# Altium project Daughter_Card.PrjPcb
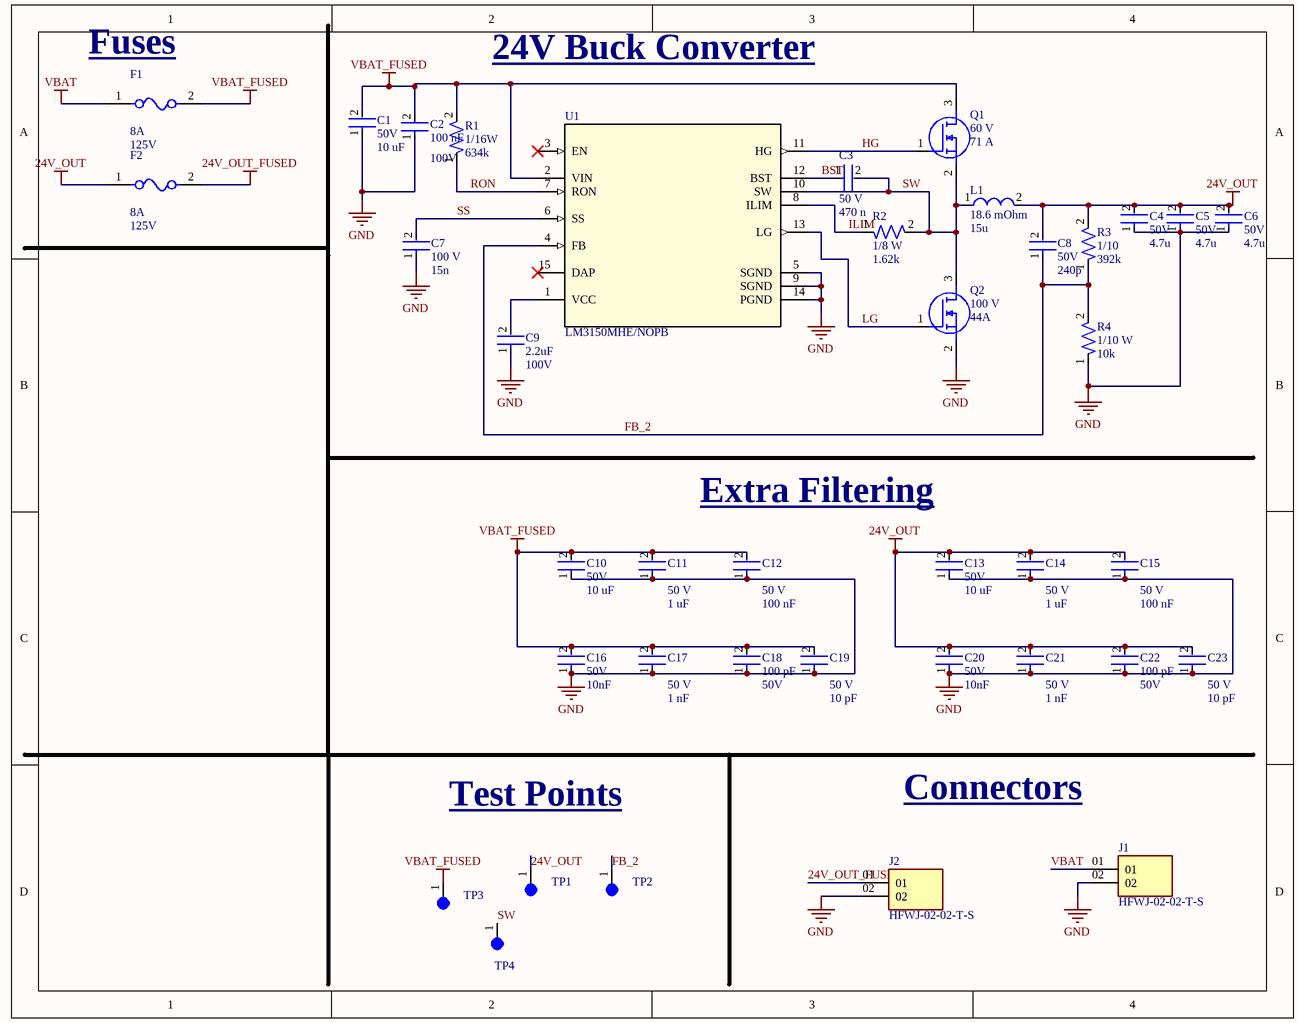
[diagram p0: Daughter_Card.SchDoc]
1 sheet, 39 parts. Net scope: global (net labels, ports and power ports of the same name join across sheets).
Board file: Daughter_Card.PcbDoc

## Sheet Daughter_Card.SchDoc
size A; SheetNumber: 1; SheetTotal: 1; SPICEModelCacheSUSSEWTI: <root> / <DocumentId>SUSSEWTI</DocumentId> / <CacheFrame Number="0"> / <Model Name="cgd" Kind="CKT"> / <Text>.subckt	cgd	1	2	3	4 / e1	5	0	value	{abs(v(3,4))} / r1	5	0	1e6 / e2	6	0	table	{v(5,0)}= / +	(	0	6.03899E-11	) / +	(	1	4.8927E-11	) / +	(	2	4.30907E-11	) / +	(	3	3.87922E-11	) / +	(	4	3.42734E-11	) / +	(	5	3.03383E-11	) / +	(	6	2.68435E-11	) / +	(	7	2.23946E-11	) / +	(	8	1.18648E-11	) / +	(	9	9.77143E-12	) / +	(	10	9.49534E-12	) / +	(	11	9.27167E-12	) / +	(	12	9.07946E-12	) / +	(	13	8.90822E-12	) / +	(	14	8.74746E-12	) / +	(	15	8.59718E-12	) / +	(	16	8.45739E-12	) / +	(	17	8.32459E-12	) / +	(	18	8.19528E-12	) / +	(	19	8.07646E-12	) / +	(	20	7.95763E-12	) / +	(	21	7.84231E-12	) / +	(	22	7.72348E-12	) / +	(	23	7.60466E-12	) / +	(	24	7.48234E-12	) / +	(	25	7.35653E-12	) / +	(	26	7.23072E-12	) / +	(	27	7.1084E-12	) / +	(	28	6.98259E-12	) / +	(	29	6.86376E-12	) / +	(	30	6.75193E-12	) / +	(	31	6.64359E-12	) / +	(	32	6.54574E-12	) / +	(	33	6.45487E-12	) / +	(	34	6.37449E-12	) / +	(	35	6.3011E-12	) / +	(	36	6.2347E-12	) / +	(	37	6.1718E-12	) / +	(	38	6.11937E-12	) / +	(	39	6.07045E-12	) / +	(	40	6.02502E-12	) / +	(	41	5.98308E-12	) / +	(	42	5.94464E-12	) / +	(	43	5.90619E-12	) / +	(	44	5.87474E-12	) / +	(	45	5.83979E-12	) / +	(	46	5.81183E-12	) / +	(	47	5.78038E-12	) / +	(	48	5.75242E-12	) / +	(	49	5.72446E-12	) / +	(	50	5.7E-12	) / +	(	51	5.67554E-12	) / +	(	52	5.65107E-12	) / +	(	53	5.6301E-12	) / +	(	54	5.60564E-12	) / +	(	55	5.58467E-12	) / +	(	56	5.5637E-12	) / +	(	57	5.54273E-12	) / +	(	58	5.52177E-12	) / +	(	59	5.5008E-12	) / +	(	60	5.48332E-12	) / +	(	61	5.46235E-12	) / +	(	62	5.44139E-12	) / +	(	63	5.42391E-12	) / +	(	64	5.40294E-12	) / +	(	65	5.38197E-12	) / +	(	66	5.36101E-12	) / +	(	67	5.34353E-12	) / +	(	68	5.32256E-12	) / +	(	69	5.30159E-12	) / +	(	70	5.28063E-12	) / +	(	71	5.25966E-12	) / +	(	72	5.24218E-12	) / +	(	73	5.22121E-12	) / +	(	74	5.20025E-12	) / +	(	75	5.18277E-12	) / +	(	76	5.1618E-12	) / +	(	77	5.14083E-12	) / +	(	78	5.12336E-12	) / +	(	79	5.10589E-12	) / +	(	80	5.08492E-12	) / +	(	81	5.06744E-12	) / +	(	82	5.04997E-12	) / +	(	83	5.0325E-12	) / +	(	84	5.01502E-12	) / +	(	85	4.99755E-12	) / +	(	86	4.98007E-12	) / +	(	87	4.9626E-12	) / +	(	88	4.94513E-12	) / +	(	89	4.93115E-12	) / +	(	90	4.91367E-12	) / +	(	91	4.89969E-12	) / +	(	92	4.88222E-12	) / +	(	93	4.86824E-12	) / +	(	94	4.85426E-12	) / +	(	95	4.84028E-12	) / +	(	96	4.8263E-12	) / +	(	97	4.8263E-12	) / +	(	98	4.83329E-12	) / +	(	99	4.83679E-12	) / +	(	100	4.84378E-12	) / r2	6	0	1e6 / c1	3	7	1e-15 / v1	7	0	DC	0.0V / e3	8	0	value	{1*I(v1)} / r3	8	0	1e6 / g1	1	2	value	{-1e15*v(6,0)*v(8,0)} / .ends cgd</Text> / </Model> / <Model Name="cds" Kind="CKT"> / <Text>.subckt	cds	1	2	3	4 / e1	5	0	value	{abs(v(3,4))} / r1	5	0	1e6 / e2	6	0	table	{v(5,0)}= / +	(	0	1.72961E-09	) / +	(	1	1.47107E-09	) / +	(	2	1.28891E-09	) / +	(	3	1.15721E-09	) / +	(	4	1.04573E-09	) / +	(	5	9.58662E-10	) / +	(	6	8.82357E-10	) / +	(	7	7.84305E-10	) / +	(	8	5.93335E-10	) / +	(	9	5.34129E-10	) / +	(	10	5.05505E-10	) / +	(	11	4.81828E-10	) / +	(	12	4.61721E-10	) / +	(	13	4.44392E-10	) / +	(	14	4.29553E-10	) / +	(	15	4.16703E-10	) / +	(	16	4.05843E-10	) / +	(	17	3.96875E-10	) / +	(	18	3.89905E-10	) / +	(	19	3.85024E-10	) / +	(	20	3.82242E-10	) / +	(	21	3.81658E-10	) / +	(	22	3.82877E-10	) / +	(	23	3.85795E-10	) / +	(	24	3.89618E-10	) / +	(	25	3.93643E-10	) / +	(	26	3.97369E-10	) / +	(	27	3.99992E-10	) / +	(	28	4.01217E-10	) / +	(	29	4.00836E-10	) / +	(	30	3.98748E-10	) / +	(	31	3.95056E-10	) / +	(	32	3.89954E-10	) / +	(	33	3.83645E-10	) / +	(	34	3.76426E-10	) / +	(	35	3.68499E-10	) / +	(	36	3.60265E-10	) / +	(	37	3.51728E-10	) / +	(	38	3.43281E-10	) / +	(	39	3.3493E-10	) / +	(	40	3.26675E-10	) / +	(	41	3.18717E-10	) / +	(	42	3.11055E-10	) / +	(	43	3.03494E-10	) / +	(	44	2.96225E-10	) / +	(	45	2.8906E-10	) / +	(	46	2.82188E-10	) / +	(	47	2.7542E-10	) / +	(	48	2.68748E-10	) / +	(	49	2.62276E-10	) / +	(	50	2.558E-10	) / +	(	51	2.49524E-10	) / +	(	52	2.43349E-10	) / +	(	53	2.3727E-10	) / +	(	54	2.31194E-10	) / +	(	55	2.25315E-10	) / +	(	56	2.19636E-10	) / +	(	57	2.14057E-10	) / +	(	58	2.08678E-10	) / +	(	59	2.03499E-10	) / +	(	60	1.98717E-10	) / +	(	61	1.94238E-10	) / +	(	62	1.89959E-10	) / +	(	63	1.86076E-10	) / +	(	64	1.82497E-10	) / +	(	65	1.79218E-10	) / +	(	66	1.76239E-10	) / +	(	67	1.73456E-10	) / +	(	68	1.70877E-10	) / +	(	69	1.68598E-10	) / +	(	70	1.66419E-10	) / +	(	71	1.6444E-10	) / +	(	72	1.62558E-10	) / +	(	73	1.60879E-10	) / +	(	74	1.593E-10	) / +	(	75	1.57817E-10	) / +	(	76	1.56438E-10	) / +	(	77	1.55159E-10	) / +	(	78	1.53877E-10	) / +	(	79	1.52794E-10	) / +	(	80	1.51715E-10	) / +	(	81	1.50733E-10	) / +	(	82	1.4975E-10	) / +	(	83	1.48868E-10	) / +	(	84	1.48085E-10	) / +	(	85	1.47302E-10	) / +	(	86	1.4652E-10	) / +	(	87	1.45837E-10	) / +	(	88	1.45155E-10	) / +	(	89	1.44569E-10	) / +	(	90	1.43986E-10	) / +	(	91	1.434E-10	) / +	(	92	1.42918E-10	) / +	(	93	1.42332E-10	) / +	(	94	1.41846E-10	) / +	(	95	1.4146E-10	) / +	(	96	1.40974E-10	) / +	(	97	1.40874E-10	) / +	(	98	1.40867E-10	) / +	(	99	1.40963E-10	) / +	(	100	1.40956E-10	) / r2	6	0	1e6 / c1	3	7	1e-15 / v1	7	0	DC	0.0V / e3	8	0	value	{1*I(v1)} / r3	8	0	1e6 / g1	1	2	value	{-1e15*v(6,0)*v(8,0)} / .ends cds</Text> / </Model> / <Model Name="vth_temp" Kind="CKT"> / <Text>******************************************************************* / .subckt vth_temp toutp	toutn / i1	0	101	1e-6 / R1	101	0	1		tc=1.00e-3, 0.00e-3 / V1	0	102	DC	1V / E1	103 102	101	0	1e6 / r2	103	0	1 / V2	104	0	DC	25V / E2	105	104	103	0	1e3 / r3	105	0	1 / E3	toutp	toutn	POLY(1) (105,0) -2.18e-2 8.63e-4 -8.22e-6 / *E3	toutp	toutn	POLY(1) (105,0) 0 0 / .ends	vth_temp</Text> / </Model> / <Model Name="csd19534q5a" Kind="CKT"> / <Text>******************************************************************* / .SUBCKT csd19534q5a  1 2 3 / * PARAMETER (local) DEFINITIONS SECTION / .PARAM  ptrc1    12.00e-3 / .PARAM  ptrc2    3.50e-5 / .PARAM  pwidthP  2.1 / .PARAM  pwidth   {pwidthP*1e6} / .PARAM  perimP   {2.1*pwidthP} / .PARAM  perim    {perimP*1e6} / ****** MODEL SUBCIRCUIT BEGINS HERE     ****************************** / M1   10 11 12 12  NMOS	W={pwidthP} L=0.5u  PS={perimP} PD={perimP} / *M2   12 11 12 20  PMOSd W={pwidthP} L=0.05u PS={perimP} PD={perimP} / *DDx  20  10  DDx / * Note:  gate oxide capacitance included in NMOS below / xcgd	5	10	1	3	cgd / cgs	5	8	0.63e-9 / *xcgs	5	8	1	3	cgs / xcds	8	10	1	3	cds / xvth	110	11	vth_temp / DBD	3	1	DBD / LGG   2  5	 2.1e-9 / RGG   5 110	 6.00 / RSB  12  9	 RTEMP 0.23166e-3 / R   9  8 	 RTEMP 0.23166e-3 / RSP   8  6 	 {0.45e-3+1.3e-3*0} / L   6  3	 0.47e-9 / RSL   6  3   0.5 / RDD   7 10 	 RTEMP 5.85e-3 / RDP   4  7	 {0.5e-4+0.52e-3+4.25e-3} / LDD   1  4	 0.05e-9 / ******************************************************************* / .MODEL  NMOS   NMOS ( / * CONTROL PARAMETERS / + LEVEL  = 7             VERSION = 3.2         CAPMOD = 2 / * DC PARAMETERS / + NLX    = 1.74E-7       VBM    = -5           DVT0   = 2.2 / + DVT1   = 0.53          DVT2   = -0.032       U0     = 600 / + UA     = 1.4e-9        UB     = 5.0e-18      A0     = 1.0 / + AGS    = 0.0           A1     = 0.0          A2     = 1.0 / + LINT   = 0.055e-6      VOFF   = 0.10        NFACTOR= 2.0 / + ETA0   = 0.005         ETAB   = -0.07        DSUB   = 1.4 / + PCLM   = 0.25          PDIBLC1= 0.02         PDIBLC2= 0.004 / + DROUT  = 0.90          PSCBE1 = 3.0e8        PSCBE2 = 1e-6 / + PVAG   = 0.1           DELTA  = 0.0220       JS     = 0 / * AC AND CAPACITANCE PARAMETERS / + CGSO   = 1e-18       CGDO   = 1e-18        CGBO   = 1e-18 / + CJ     = 1e-18         CJSW   = 1e-18        CF     = 0 / * TEMPERATURE PARAMETERS / + TNOM   = 25            UTE    = -1.5         KT1    = -1.125 / + KT1L   = 1.0e-15       KT2    = 0.022        UA1    = 0.25e-10 / + UB1    = -0.8e-18 / * PROCE PARAMETERS / + TOX    = 4.00e-8       XJ     = 3e-7          NCH    = 1.395e17 / + NSUB   = 1.0e16) / ******************************************************************* / .MODEL  PMOSd   PMOS (   LEVEL  = 1 / + TNOM   = 27            VTO    = -0.3          IS     = 6.0e-14 / + TOX    = 4.00e-8       NSUB   = 1.5e18		gamma	=	10 / + CJ     = 1e-18         CJSW   = 1e-18 / + CGSO   = 1e-18         CGDO   = 1e-18         CGBO   = 0  ) / ******************************************************************* / .MODEL DBD D (CJO=7.50e-15 VJ=0.5 M=0.625 TNOM=25 / + FC=0.5 TT=2e-09 XTI=3.3 BV=101 / + IS=1.5e-12 N=1.06 RS=1.60e-3 TRS1=4.0e-3) / ******************************************************************* / .MODEL RTEMP RES (TC1={ptrc1} TC2={ptrc2}) / ******************************************************************* / .ENDS csd19534q5a</Text> / <Dependency>0\cgd</Dependency> / <Dependency>0\cds</Dependency> / <Dependency>0\vth_temp</Dependency> / </Model> / </CacheFrame> / </root>

### Parts
C1  Voltage: 50V  Capacitance: 10 uF  [CAP-1210]  (hidden comment: CL32B106KBJNNNE)
C2  Capacitance: 100 nF  Voltage: 100V  [CAP-0603]  (hidden comment: GMC10X7S104K100NT)
C3  Voltage: 50 V  Capacitance: 470 n  [CAP-0805]  (hidden comment: CC0805ZRY5V9BB474)
C4  Voltage: 50V  Capacitance: 4.7u  [CAP-1210]  (hidden comment: CC1210KFX7R9BB475)
C5  Voltage: 50V  Capacitance: 4.7u  [CAP-1210]  (hidden comment: CC1210KFX7R9BB475)
C6  Voltage: 50V  Capacitance: 4.7u  [CAP-1210]  (hidden comment: CC1210KFX7R9BB475)
C7  Voltage: 100 V  Capacitance: 15n  [CAP-0805]  (hidden comment: CC0805KRX7R0BB153)
C8  Voltage: 50V  Capacitance: 240p  [CAP-0402]  (hidden comment: CC0402FRNPO9BN241)
C9  Capacitance: 2.2uF  Voltage: 100V  [CAP-1206]  (hidden comment: CC1206KKX7R0BB225)
C10  Voltage: 50V  Capacitance: 10 uF  [CAP-1210]  (hidden comment: CL32B106KBJNNNE)
C11  Voltage: 50 V  Capacitance: 1 uF  [CAP-0805]  (hidden comment: CC0805KKX7R9BB105)
C12  Voltage: 50 V  Capacitance: 100 nF  [CAP-0805]  (hidden comment: CC0805KRX7R9BB104)
C13  Voltage: 50V  Capacitance: 10 uF  [CAP-1210]  (hidden comment: CL32B106KBJNNNE)
C14  Voltage: 50 V  Capacitance: 1 uF  [CAP-0805]  (hidden comment: CC0805KKX7R9BB105)
C15  Voltage: 50 V  Capacitance: 100 nF  [CAP-0805]  (hidden comment: CC0805KRX7R9BB104)
C16  Voltage: 50V  Capacitance: 10nF  [CAP-0805]  (hidden comment: GRM2195C1H103JA01D)
C17  Voltage: 50 V  Capacitance: 1 nF  [CAP-0402]  (hidden comment: CC0402KRX7R9BB102)
C18  Capacitance: 100 pF  Voltage: 50V  [CAP-0402]  (hidden comment: CC0402JRNPO9BN101)
C19  Voltage: 50 V  Capacitance: 10 pF  [CAP-0402]  (hidden comment: CC0402JRNPO9BN100)
C20  Voltage: 50V  Capacitance: 10nF  [CAP-0805]  (hidden comment: GRM2195C1H103JA01D)
C21  Voltage: 50 V  Capacitance: 1 nF  [CAP-0402]  (hidden comment: CC0402KRX7R9BB102)
C22  Capacitance: 100 pF  Voltage: 50V  [CAP-0402]  (hidden comment: CC0402JRNPO9BN101)
C23  Voltage: 50 V  Capacitance: 10 pF  [CAP-0402]  (hidden comment: CC0402JRNPO9BN100)
F1  Fuse Current: 8A  Voltage Rating: 125V  [FUSE-0001]  (hidden comment: 01550900M)
F2  Fuse Current: 8A  Voltage Rating: 125V  [FUSE-0001]  (hidden comment: 01550900M)
J1  HFWJ-02-02-T-S  [SAMTEC_HFWJ-02-02-T-S]
J2  HFWJ-02-02-T-S  [SAMTEC_HFWJ-02-02-T-S]
L1  Resistance: 18.6 mOhm  Inductor: 15u  [IND_XAL1010_COC]  (hidden comment: XAL1010-153MED)
Q1  Max Voltage: 60 V  Max Current: 71 A  [NTMFS5C670NLT1G_ONS - duplicate]  (hidden comment: NTMFS5C670NLT1G)
Q2  Voltage Max: 100 V  Current Max: 44A  [TRANS_CSD19534Q5A]  (hidden comment: CSD19534Q5A)
R1  Power: 1/16W  Resistance: 634k  [RES-0402]  (hidden comment: RC0402FR-07634KL)
R2  Power: 1/8 W  Resistance: 1.62k  [RES-0805]  (hidden comment: RC0805FR-071K62L)
R3  Power: 1/10  Resistance: 392k  [RES-0603]  (hidden comment: RC0603FR-07392KL)
R4  Power: 1/10 W  Resistance: 10k  [CAP-0603]  (hidden comment: RC0603FR-0710KL)
TP1  5003  [TEST-POINT-0001]  (value not drawn)
TP2  5003  [TEST-POINT-0001]  (value not drawn)
TP3  5003  [TEST-POINT-0001]  (value not drawn)
TP4  5003  [TEST-POINT-0001]  (value not drawn)
U1  LM3150MHE/NOPB  [MXA14A]

### Nets
24V_OUT: C4.2 C5.2 C6.2 C8.2 C13.2 C14.2 C15.2 C20.2 C21.2 C22.2 C23.2 F2.1 L1.2 R3.2 TP1.1
24V_OUT_FUSED: F2.2 J2.01
GND: C1.1 C2.1 C4.1 C5.1 C6.1 C7.1 C9.1 C10.1 C11.1 C12.1 C13.1 C14.1 C15.1 C16.1 C17.1 C18.1 C19.1 C20.1 C21.1 C22.1 C23.1 J1.02 J2.02 Q2.2(S) R4.1 U1.5(SGND) U1.9(SGND) U1.14(PGND)
VBAT: F1.1 J1.01
VBAT_FUSED: C1.2 C2.2 C10.2 C11.2 C12.2 C16.2 C17.2 C18.2 C19.2 F1.2 Q1.3(D) R1.2 TP3.1 U1.2(VIN)
BST: C3.1 U1.12(BST)
FB_2: C8.1 R3.1 R4.2 TP2.1 U1.4(FB)
HG: Q1.1(G) U1.11(HG)
ILIM: R2.1 U1.8(ILIM)
LG: Q2.1(G) U1.13(LG)
RON: R1.1 U1.7(RON)
SS: C7.2 U1.6(SS)
SW: C3.2 L1.1 Q1.2(S) Q2.3(D) R2.2 TP4.1 U1.10(SW)
NetC9_2: C9.2 U1.1(VCC)

Not connected (* = marked no-connect by the designer): U1 3(EN)* 15(DAP)*

### Notes on the sheet
- (near F1) Fuses
- 24V Buck Converter
- Extra Filtering
- Test Points
- Connectors

### Library data of the parts
C1 C10 C13 = CAP-10U-0002: CAP CER 10UF 50V X7R 1210; Device Class: Ceramic; Size: 1210; ComponentLink1Description: Datasheet; ComponentLink1URL: https://mm.digikey.com/Volume0/opasdata/d220001/medias/docus/41/CL32B106KBJNNNE_Spec.pdf
C2 = CAP-100N-0001: 0.1 µF ±10% 100V Ceramic Capacitor X7S 0603 (1608 Metric)
C3 = CAP-470N-0002: 0.47 µF -20%, +80% 50V Ceramic Capacitor Y5V (F) 0805 (2012 Metric)
C4-C6 = CAP-4.7U-0003: 4.7 µF ±10% 50V Ceramic Capacitor X7R 1210 (3225 Metric)
C7 = CAP-15N-0001: 0.015 µF ±10% 100V Ceramic Capacitor X7R 0805 (2012 Metric)
C8 = CAP-240P-0001: 240 pF ±1% 50V Ceramic Capacitor C0G, NP0 0402 (1005 Metric)
C9 = CAP-2.2U-0001: CAP CER 2.2UF 100V X7R 1206; Device Class: Ceramic; Size: 1206; ComponentLink1Description: Datasheet; ComponentLink1URL: https://www.yageo.com/upload/media/product/productsearch/datasheet/mlcc/UPY-GPHC_X7R_6.3V-to-250V_24.pdf
C11 C14 = CAP-1U-0001: 1 µF ±10% 50V Ceramic Capacitor X7R 0805 (2012 Metric)
C12 C15 = CAP-100N-0002: 0.1 µF ±10% 50V Ceramic Capacitor X7R 0805 (2012 Metric)
C16 C20 = CAP-10N-0001: CAP CER 10000PF 50V C0G/NP0 0805; Device Class: Ceramic; Size: 0805; ComponentLink1Description: Datasheet; ComponentLink1URL: https://search.murata.co.jp/Ceramy/image/img/A01X/G101/ENG/GRM2195C1H103JA01-01.pdf
C17 C21 = CAP-1N-0001: 1000 pF ±10% 50V Ceramic Capacitor X7R 0402 (1005 Metric)
C18 C22 = CAP-100P-0001: CAP CER 100PF 50V C0G/NPO 0402; Device Class: Ceramic; Size: 0402; ComponentLink1Description: Datasheet; ComponentLink1URL: https://www.yageo.com/upload/media/product/productsearch/datasheet/mlcc/UPY-GP_NP0_16V-to-50V_18.pdf
C19 C23 = CAP-10P-0001: 10 pF ±5% 50V Ceramic Capacitor C0G, NP0 0402 (1005 Metric)
F1 F2 = FUSE-0001: FUSE BLOK CARTRIDGE 125V 10A SMD; ComponentLink2Description: Datasheet; ComponentLink2URL: https://www.littelfuse.com/~/media/electronics/datasheets/fuses/littelfuse_fuse_154_154t_154l_154tl_datasheet.pdf.pdf
J1 J2 = CONN-2POS-0007: Conn Unshrouded Header HDR 2 POS 3.96mm Solder ST Thru-Hole Bulk; MF: Samtec; SnapEDA_Link: https://www.snapeda.com/parts/HFWJ-02-02-T-S/Samtec/view-part/?ref=snap; Package: None; Value: *; MP: HFWJ-02-02-T-S; Check_prices: https://www.snapeda.com/parts/HFWJ-02-02-T-S/Samtec/view-part/?ref=eda
L1 = IND-15u-0001: 15 µH Shielded Molded Inductor 9.9 A 18.6mOhm Max Nonstandard; Manufacturer_Name: Coilcraft; Copyright: Copyright (C) 2025 Ultra Librarian. All rights reserved.; Manufacturer_Part_Number: XAL1010-153MED
Q1 = NMOS-71A-0001: N-Channel 60 V 17A (Ta), 71A (Tc) 3.6W (Ta), 61W (Tc) Surface Mount 5-DFN (5x6) (8-SOFL); Manufacturer_Name: onsemi; Copyright: Copyright (C) 2025 Ultra Librarian. All rights reserved.; Manufacturer_Part_Number: NTMFS5C670NLT1G; RefDes: RefDes; Type: Type
Q2 = NMOS-44A-0001: N-Channel 100 V 44A (Tc) 3.2W (Ta), 63W (Tc) Surface Mount 8-VSONP (5x6); MF: Texas Instruments; Mouser-Purchase-URL: https://snapeda.com/shop?store=Mouser&id=485742; Package: VSONP-8 Texas Instruments; Texas_Instruments-Purchase-URL: https://snapeda.com/shop?store=Texas+Instruments&id=485742; Value: *; Price: None; DigiKey-Purchase-URL: https://snapeda.com/shop?store=DigiKey&id=485742; MP: CSD19534Q5A; SnapEDA_Link: https://www.snapeda.com/parts/CSD19534Q5A/Texas%20Instruments/view-part/485742/?ref=snap; Availability: Good
R1 = RES-634k-0001: 634 kOhms ±1% 0.063W, 1/16W Chip Resistor 0402 (1005 Metric) Moisture Resistant Thick Film
R2 = RES-1.62k-001: 1.62 kOhms ±1% 0.125W, 1/8W Chip Resistor 0805 (2012 Metric) Moisture Resistant Thick Film
R3 = RES-392k-0001: 392 kOhms ±1% 0.1W, 1/10W Chip Resistor 0603 (1608 Metric) Moisture Resistant Thick Film
R4 = RES-10k-0002: 10 kOhms ±1% 0.1W, 1/10W Chip Resistor 0603 (1608 Metric) Moisture Resistant Thick Film
TP1-TP4 = TEST-POINT-0001: Oranange PC Test Point, Miniature Phoisphor Bronze Silver Plating Through Hole Mounting Type
U1 = IC-BUCK_0011: 6V to 42V Synchronous Step-Down Controller with Adjustable Output Voltage 14-HTSSOP -40 to 125; Manufacturer_Name: Texas Instruments; Copyright: Copyright (C) 2025 Ultra Librarian. All rights reserved.; Manufacturer_Part_Number: LM3150MHE/NOPB; Datasheet: https://www.ti.com/lit/gpn/lm3150; RefDes: RefDes; Type: Type